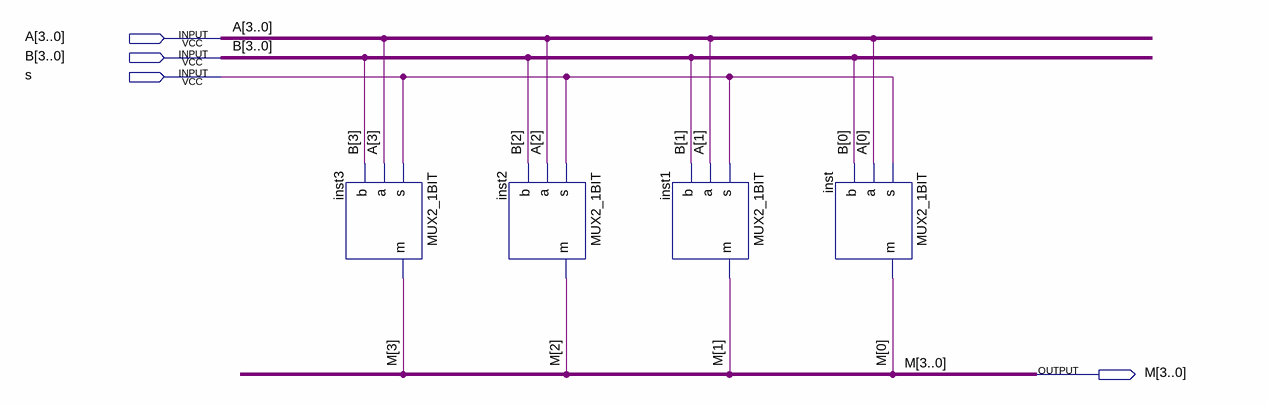
[diagram p0: schematic sheet]
// Quartus schematic MUX2_1_4BIT.bdf as structural Verilog: 4 symbols, 4 pins
module MUX2_1_4BIT (
  input  [3:0] A,
  input  [3:0] B,
  input  s,
  output [3:0] M
);

  MUX2_1BIT inst3 (.s(s), .a(A[3]), .b(B[3]), .m(M[3]));
  MUX2_1BIT inst2 (.s(s), .a(A[2]), .b(B[2]), .m(M[2]));
  MUX2_1BIT inst1 (.s(s), .a(A[1]), .b(B[1]), .m(M[1]));
  MUX2_1BIT inst (.s(s), .a(A[0]), .b(B[0]), .m(M[0]));
endmodule
